# EAGLE schematic Hive 1.6 (EAGLE 9.6.2)
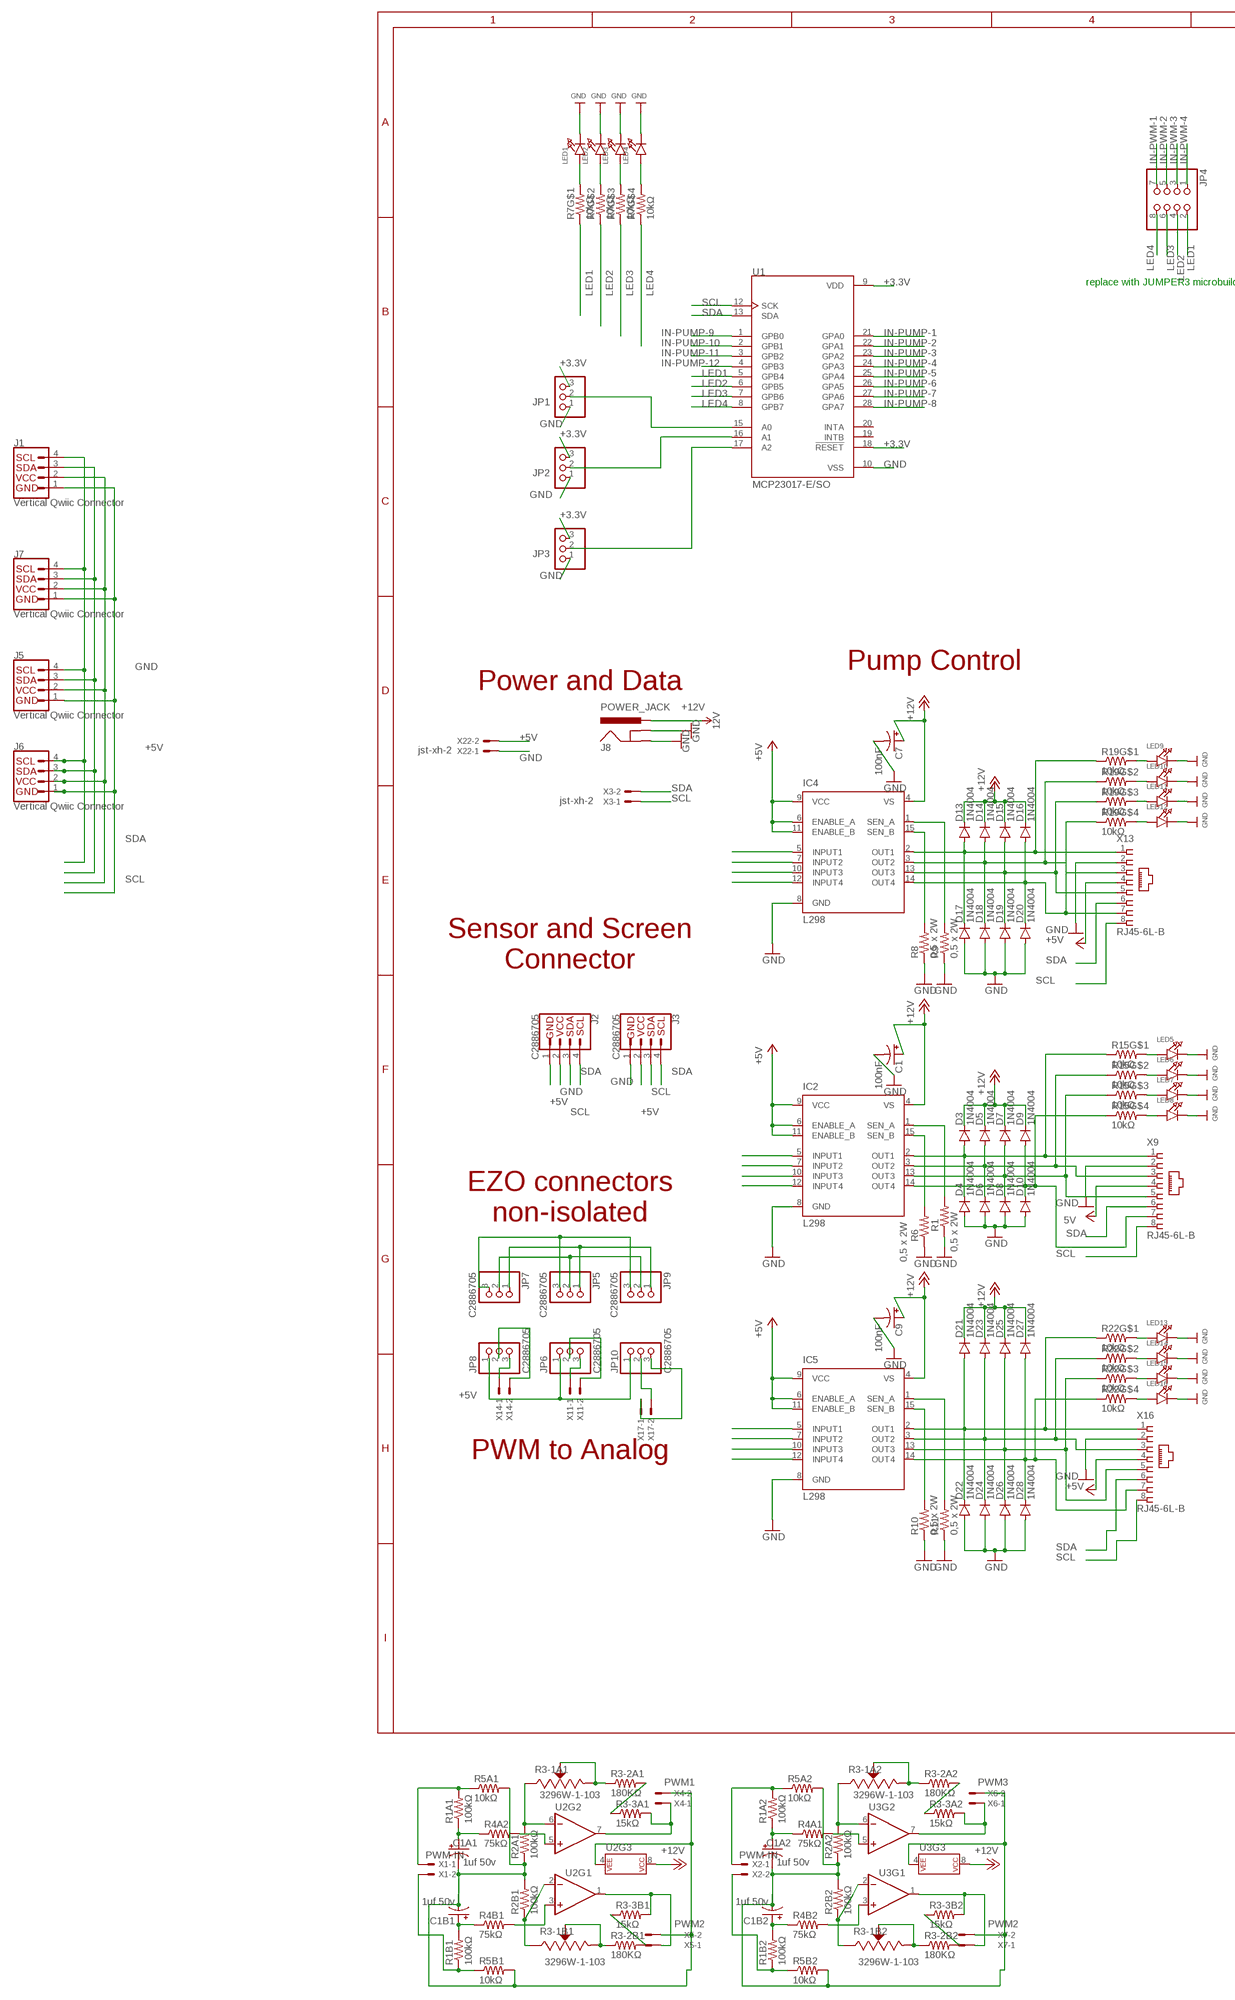
[diagram p0: schematic, sheet 1, part 1 of 2]
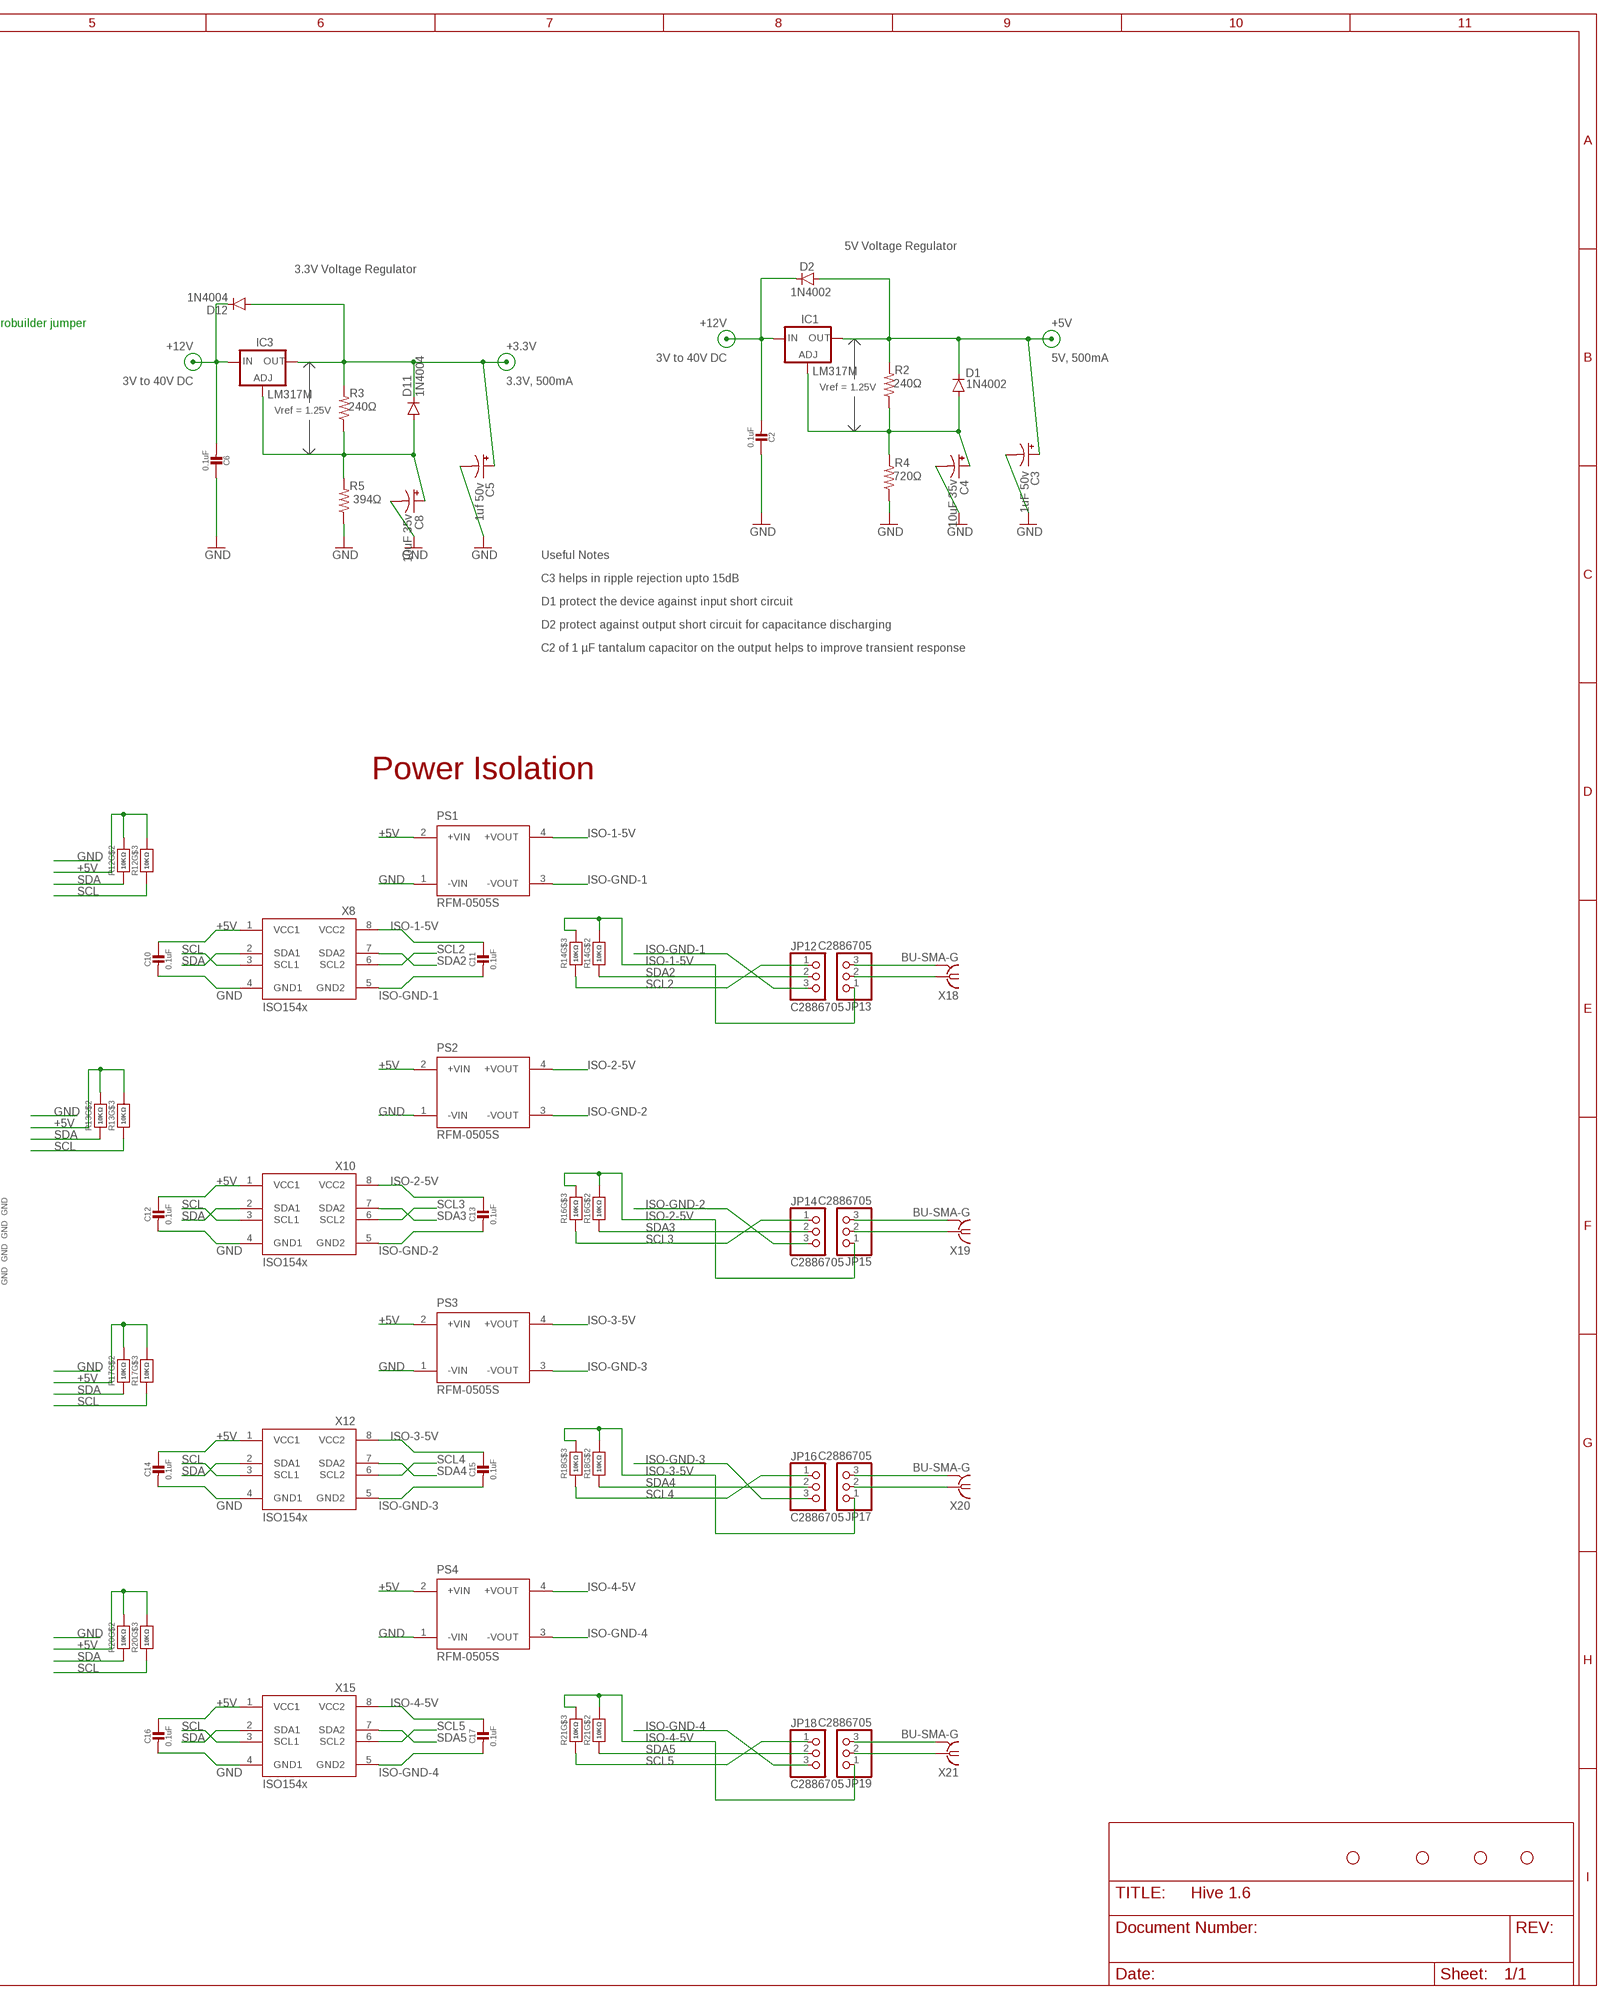
[diagram p1: schematic, sheet 1, part 2 of 2]

## Parts
C1  100nF  CPOL-USUD-4X5,8  [UD-4X5,8_NICHICON]
C1A1  1uf 50v  CPOL-USUD-4X5,8  [UD-4X5,8_NICHICON]
C1A2  1uf 50v  CPOL-USUD-4X5,8  [UD-4X5,8_NICHICON]
C1B1  1uf 50v  CPOL-USUD-4X5,8  [UD-4X5,8_NICHICON]
C1B2  1uf 50v  CPOL-USUD-4X5,8  [UD-4X5,8_NICHICON]
C2  0.1uF  CAP_CERAMIC0603_NO  [0603-NO]
C3  1uF 50v  CPOL-USUD-4X5,8  [UD-4X5,8_NICHICON]
C4  10uF 35v  CPOL-USUD-4X5,8  [UD-4X5,8_NICHICON]
C5  1uf 50v  CPOL-USUD-4X5,8  [UD-4X5,8_NICHICON]
C6  0.1uF  CAP_CERAMIC0603_NO  [0603-NO]
C7  100nF  CPOL-USUD-4X5,8  [UD-4X5,8_NICHICON]
C8  10uF 35v  CPOL-USUD-4X5,8  [UD-4X5,8_NICHICON]
C9  100nF  CPOL-USUD-4X5,8  [UD-4X5,8_NICHICON]
C10  0.1uF  CAP_CERAMIC0603_NO  [0603-NO]
C11  0.1uF  CAP_CERAMIC0603_NO  [0603-NO]
C12  0.1uF  CAP_CERAMIC0603_NO  [0603-NO]
C13  0.1uF  CAP_CERAMIC0603_NO  [0603-NO]
C14  0.1uF  CAP_CERAMIC0603_NO  [0603-NO]
C15  0.1uF  CAP_CERAMIC0603_NO  [0603-NO]
C16  0.1uF  CAP_CERAMIC0603_NO  [0603-NO]
C17  0.1uF  CAP_CERAMIC0603_NO  [0603-NO]
D1  1N4002  DIODE-DO214BA  [DO214BA]
D2  1N4002  DIODE-DO214BA  [DO214BA]
D3  1N4004  DIODE-DO214BA  [DO214BA]
D4  1N4004  DIODE-DO214BA  [DO214BA]
D5  1N4004  DIODE-DO214BA  [DO214BA]
D6  1N4004  DIODE-DO214BA  [DO214BA]
D7  1N4004  DIODE-DO214BA  [DO214BA]
D8  1N4004  DIODE-DO214BA  [DO214BA]
D9  1N4004  DIODE-DO214BA  [DO214BA]
D10  1N4004  DIODE-DO214BA  [DO214BA]
D11  1N4004  DIODE-DO214BA  [DO214BA]
D12  1N4004  DIODE-DO214BA  [DO214BA]
D13  1N4004  DIODE-DO214BA  [DO214BA]
D14  1N4004  DIODE-DO214BA  [DO214BA]
D15  1N4004  DIODE-DO214BA  [DO214BA]
D16  1N4004  DIODE-DO214BA  [DO214BA]
D17  1N4004  DIODE-DO214BA  [DO214BA]
D18  1N4004  DIODE-DO214BA  [DO214BA]
D19  1N4004  DIODE-DO214BA  [DO214BA]
D20  1N4004  DIODE-DO214BA  [DO214BA]
D21  1N4004  DIODE-DO214BA  [DO214BA]
D22  1N4004  DIODE-DO214BA  [DO214BA]
D23  1N4004  DIODE-DO214BA  [DO214BA]
D24  1N4004  DIODE-DO214BA  [DO214BA]
D25  1N4004  DIODE-DO214BA  [DO214BA]
D26  1N4004  DIODE-DO214BA  [DO214BA]
D27  1N4004  DIODE-DO214BA  [DO214BA]
D28  1N4004  DIODE-DO214BA  [DO214BA]
H1  STAND-OFF  [STAND-OFF]
H2  STAND-OFF  [STAND-OFF]
H3  STAND-OFF  [STAND-OFF]
H4  STAND-OFF  [STAND-OFF]
IC1  LM317MBSTT3  [SOT223]
IC2  L298  [MULTIWATT-15]
IC3  LM317MBSTT3  [SOT223]
IC4  L298  [MULTIWATT-15]
IC5  L298  [MULTIWATT-15]
J1  Vertical Qwiic Connector  QWIIC_CONNECTOR  [JST04_1MM_VERT]
J2  C2886705  I2C_STANDARD  [1X04]
J3  C2886705  I2C_STANDARD  [1X04]
J5  Vertical Qwiic Connector  QWIIC_CONNECTOR  [JST04_1MM_VERT]
J6  Vertical Qwiic Connector  QWIIC_CONNECTOR  [JST04_1MM_VERT]
J7  Vertical Qwiic Connector  QWIIC_CONNECTOR  [JST04_1MM_VERT]
J8  POWER_JACK  [POWER_JACK_PTH]
JP1  HEADER-1X3ROUND  [1X03_ROUND]
JP2  HEADER-1X3ROUND  [1X03_ROUND]
JP3  HEADER-1X3ROUND  [1X03_ROUND]
JP4  PINHD-2X4  [2X04]
JP5  C2886705  PINHD-1X3CB  [1X03-CLEANBIG]
JP6  C2886705  PINHD-1X3CB  [1X03-CLEANBIG]
JP7  C2886705  PINHD-1X3CB  [1X03-CLEANBIG]
JP8  C2886705  PINHD-1X3CB  [1X03-CLEANBIG]
JP9  C2886705  PINHD-1X3CB  [1X03-CLEANBIG]
JP10  C2886705  PINHD-1X3CB  [1X03-CLEANBIG]
JP12  C2886705  PINHD-1X3CB  [1X03-CLEANBIG]
JP13  C2886705  PINHD-1X3CB  [1X03-CLEANBIG]
JP14  C2886705  PINHD-1X3CB  [1X03-CLEANBIG]
JP15  C2886705  PINHD-1X3CB  [1X03-CLEANBIG]
JP16  C2886705  PINHD-1X3CB  [1X03-CLEANBIG]
JP17  C2886705  PINHD-1X3CB  [1X03-CLEANBIG]
JP18  C2886705  PINHD-1X3CB  [1X03-CLEANBIG]
JP19  C2886705  PINHD-1X3CB  [1X03-CLEANBIG]
LED1  LED0603  [CHIPLED_0603]
LED2  LED0603  [CHIPLED_0603]
LED3  LED0603  [CHIPLED_0603]
LED4  LED0603  [CHIPLED_0603]
LED5  LED0603  [CHIPLED_0603]
LED6  LED0603  [CHIPLED_0603]
LED7  LED0603  [CHIPLED_0603]
LED8  LED0603  [CHIPLED_0603]
LED9  LED0603  [CHIPLED_0603]
LED10  LED0603  [CHIPLED_0603]
LED11  LED0603  [CHIPLED_0603]
LED12  LED0603  [CHIPLED_0603]
LED13  LED0603  [CHIPLED_0603]
LED14  LED0603  [CHIPLED_0603]
LED15  LED0603  [CHIPLED_0603]
LED16  LED0603  [CHIPLED_0603]
PS1  RFM-0505S  [CONV_RFM-0505S]
PS2  RFM-0505S  [CONV_RFM-0505S]
PS3  RFM-0505S  [CONV_RFM-0505S]
PS4  RFM-0505S  [CONV_RFM-0505S]
R1  0,5 x 2W  R-US_R2512  [R2512]
R1A1  100kΩ  R-US_M1206  [M1206]
R1A2  100kΩ  R-US_M1206  [M1206]
R1B1  100kΩ  R-US_M1206  [M1206]
R1B2  100kΩ  R-US_M1206  [M1206]
R2  240Ω  R-US_M0805  [M0805]
R2A1  100kΩ  R-US_M1206  [M1206]
R2A2  100kΩ  R-US_M1206  [M1206]
R2B1  100kΩ  R-US_M1206  [M1206]
R2B2  100kΩ  R-US_M1206  [M1206]
R3  240Ω  R-US_M0805  [M0805]
R3-1A1  3296W-1-103  [TRIM_3296W-1-103]
R3-1A2  3296W-1-103  [TRIM_3296W-1-103]
R3-1B1  3296W-1-103  [TRIM_3296W-1-103]
R3-1B2  3296W-1-103  [TRIM_3296W-1-103]
R3-2A1  180KΩ  R-US_M1206  [M1206]
R3-2A2  180KΩ  R-US_M1206  [M1206]
R3-2B1  180KΩ  R-US_M1206  [M1206]
R3-2B2  180KΩ  R-US_M1206  [M1206]
R3-3A1  15kΩ  R-US_M1206  [M1206]
R3-3A2  15kΩ  R-US_M1206  [M1206]
R3-3B1  15kΩ  R-US_M1206  [M1206]
R3-3B2  15kΩ  R-US_M1206  [M1206]
R4  720Ω  R-US_M0805  [M0805]
R4A1  75kΩ  R-US_M1206  [M1206]
R4A2  75kΩ  R-US_M1206  [M1206]
R4B1  75kΩ  R-US_M1206  [M1206]
R4B2  75kΩ  R-US_M1206  [M1206]
R5  394Ω  R-US_M0805  [M0805]
R5A1  10kΩ  R-US_M1206  [M1206]
R5A2  10kΩ  R-US_M1206  [M1206]
R5B1  10kΩ  R-US_M1206  [M1206]
R5B2  10kΩ  R-US_M1206  [M1206]
R6  0,5 x 2W  R-US_R2512  [R2512]
R7  10kΩ  RESISTOR_4PACK_US  [RESPACK_4X0603]
R8  0,5 x 2W  R-US_R2512  [R2512]
R9  0,5 x 2W  R-US_R2512  [R2512]
R10  0,5 x 2W  R-US_R2512  [R2512]
R11  0,5 x 2W  R-US_R2512  [R2512]
R12  10KΩ  RESISTOR_4PACK  [RESPACK_4X0603]
R13  10KΩ  RESISTOR_4PACK  [RESPACK_4X0603]
R14  10KΩ  RESISTOR_4PACK  [RESPACK_4X0603]
R15  10kΩ  RESISTOR_4PACK_US  [RESPACK_4X0603]
R16  10KΩ  RESISTOR_4PACK  [RESPACK_4X0603]
R17  10KΩ  RESISTOR_4PACK  [RESPACK_4X0603]
R18  10KΩ  RESISTOR_4PACK  [RESPACK_4X0603]
R19  10kΩ  RESISTOR_4PACK_US  [RESPACK_4X0603]
R20  10KΩ  RESISTOR_4PACK  [RESPACK_4X0603]
R21  10KΩ  RESISTOR_4PACK  [RESPACK_4X0603]
R22  10kΩ  RESISTOR_4PACK_US  [RESPACK_4X0603]
U1  MCP23017-E/SO  [SOIC127P1030X265-28N]
U2  LM358  LM358SO08  [SO08]
U3  LM358  LM358SO08  [SO08]
X1  PWM-IN  JST-XH-02-PIN-LONG-PAD  [JST-XH-02-PACKAGE-LONG-PAD]
X2  PWM-IN  JST-XH-02-PIN-LONG-PAD  [JST-XH-02-PACKAGE-LONG-PAD]
X3  jst-xh-2  JST-XH-02-PIN-LONG-PAD  [JST-XH-02-PACKAGE-LONG-PAD]
X4  PWM1  JST-XH-02-PIN-LONG-PAD  [JST-XH-02-PACKAGE-LONG-PAD]
X5  PWM2  JST-XH-02-PIN-LONG-PAD  [JST-XH-02-PACKAGE-LONG-PAD]
X6  PWM3  JST-XH-02-PIN-LONG-PAD  [JST-XH-02-PACKAGE-LONG-PAD]
X7  PWM2  JST-XH-02-PIN-LONG-PAD  [JST-XH-02-PACKAGE-LONG-PAD]
X8  ISO154X  [SOIC8_150MIL]
X9  RJ45-6L-B  [RJ45-NO-SHIELD]
X10  ISO154X  [SOIC8_150MIL]
X11  jst-xh-2  JST-XH-02-PIN-LONG-PAD  [JST-XH-02-PACKAGE-LONG-PAD]
X12  ISO154X  [SOIC8_150MIL]
X13  RJ45-6L-B  [RJ45-NO-SHIELD]
X14  jst-xh-2  JST-XH-02-PIN-LONG-PAD  [JST-XH-02-PACKAGE-LONG-PAD]
X15  ISO154X  [SOIC8_150MIL]
X16  RJ45-6L-B  [RJ45-NO-SHIELD]
X17  jst-xh-2  JST-XH-02-PIN-LONG-PAD  [JST-XH-02-PACKAGE-LONG-PAD]
X18  BU-SMA-G  [BU-SMA-G]
X19  BU-SMA-G  [BU-SMA-G]
X20  BU-SMA-G  [BU-SMA-G]
X21  BU-SMA-G  [BU-SMA-G]
X22  jst-xh-2  JST-XH-02-PIN-LONG-PAD  [JST-XH-02-PACKAGE-LONG-PAD]

## Nets
+3.3V [3.3v]: C5.+ D11.C D12.A IC3.4(OUT) JP1.3 JP2.3 JP3.3 R3.2 U1.9(VDD) U1.18(!RESET)
+5V [5v]: C3.+ C10.1 C12.1 C14.1 C16.1 D1.C D2.A IC1.4(OUT) IC2.6(ENABLE_A) IC2.9(VCC) IC2.11(ENABLE_B) IC4.6(ENABLE_A) IC4.9(VCC) IC4.11(ENABLE_B) IC5.6(ENABLE_A) IC5.9(VCC) IC5.11(ENABLE_B) J1.3 J2.1 J3.2 J5.3 J6.3 J7.3 JP6.1 JP8.1 JP10.1 PS1.2(+VIN) PS2.2(+VIN) PS3.2(+VIN) PS4.2(+VIN) R2.2 R12.6 R12.7 R13.6 R13.7 R17.6 R17.7 R20.6 R20.7 X8.1(VCC1) X9.4 X10.1(VCC1) X12.1(VCC1) X13.4 X15.1(VCC1) X16.4 X22.2 ; supply symbol labelled +3V3
+12V [12v]: C1.+ C2.2 C6.2 C7.+ C9.+ D2.C D3.C D5.C D7.C D9.C D12.C D13.C D14.C D15.C D16.C D21.C D23.C D25.C D27.C IC1.3(IN) IC2.4(VS) IC3.3(IN) IC4.4(VS) IC5.4(VS) J8.PWR U2.8(P$V+) U3.8(P$V+) ; supply symbol labelled 12V
GND: C1.- C1A1.- C1A2.- C1B1.- C1B2.- C2.1 C3.- C4.- C5.- C6.1 C7.- C8.- C9.- C10.2 C12.2 C14.2 C16.2 D4.A D6.A D8.A D10.A D17.A D18.A D19.A D20.A D22.A D24.A D26.A D28.A IC2.8(GND) IC4.8(GND) IC5.8(GND) J1.4 J2.2 J3.1 J5.4 J6.4 J7.4 J8.GND J8.GNDBREAK JP1.1 JP2.1 JP3.1 JP5.3 JP7.3 JP9.3 LED1.C LED2.C LED3.C LED4.C LED5.C LED6.C LED7.C LED8.C LED9.C LED10.C LED11.C LED12.C LED13.C LED14.C LED15.C LED16.C PS1.1(-VIN) PS2.1(-VIN) PS3.1(-VIN) PS4.1(-VIN) R1.1 R2A1.1 R2A2.1 R2B1.2 R2B2.2 R4.1 R5.1 R5A1.2 R5A2.2 R5B1.2 R5B2.2 R6.1 R8.1 R9.1 R10.1 R11.1 U1.10(VSS) U2.4(P$V-) U3.4(P$V-) X4.2 X5.2 X6.2 X7.2 X8.4(GND1) X9.2 X10.4(GND1) X12.4(GND1) X13.2 X15.4(GND1) X16.2 X22.1
IN-PUMP-1: IC2.5(INPUT1) U1.21(GPA0)
IN-PUMP-2: IC2.7(INPUT2) U1.22(GPA1)
IN-PUMP-3: IC2.10(INPUT3) U1.23(GPA2)
IN-PUMP-4: IC2.12(INPUT4) U1.24(GPA3)
IN-PUMP-5 [GPIO]: IC4.5(INPUT1) U1.25(GPA4)
IN-PUMP-6 [GPIO]: IC4.7(INPUT2) U1.26(GPA5)
IN-PUMP-7 [GPIO]: IC4.10(INPUT3) U1.27(GPA6)
IN-PUMP-8 [GPIO]: IC4.12(INPUT4) U1.28(GPA7)
IN-PUMP-9 [GPIO]: IC5.5(INPUT1) U1.1(GPB0)
IN-PUMP-10 [GPIO]: IC5.7(INPUT2) U1.2(GPB1)
IN-PUMP-11 [GPIO]: IC5.10(INPUT3) U1.3(GPB2)
IN-PUMP-12 [GPIO]: IC5.12(INPUT4) U1.4(GPB3)
IN-PWM-1: JP4.7 R1A1.2 R5A1.1 X1.1
IN-PWM-2: JP4.5 R1B1.1 R5B1.1 X1.2
IN-PWM-3: JP4.3 R1A2.2 R5A2.1 X2.1
IN-PWM-4: JP4.1 R1B2.1 R5B2.1 X2.2
ISO-1-5V: C11.1 JP13.1 PS1.4(+VOUT) R14.6 R14.7 X8.8(VCC2)
ISO-2-5V: C13.1 JP15.1 PS2.4(+VOUT) R16.6 R16.7 X10.8(VCC2)
ISO-3-5V: C15.1 JP17.1 PS3.4(+VOUT) R18.6 R18.7 X12.8(VCC2)
ISO-4-5V: C17.1 JP19.1 PS4.4(+VOUT) R21.6 R21.7 X15.8(VCC2)
ISO-GND-1: C11.2 JP12.3 PS1.3(-VOUT) X8.5(GND2)
ISO-GND-2: C13.2 JP14.3 PS2.3(-VOUT) X10.5(GND2)
ISO-GND-3: C15.2 JP16.3 PS3.3(-VOUT) X12.5(GND2)
ISO-GND-4: C17.2 JP18.3 PS4.3(-VOUT) X15.5(GND2)
ISO-PRB-1+: JP13.2 X18.1
ISO-PRB-1GND: JP13.3 X18.2 X18.3 X18.4 X18.5
ISO-PRB-2+: JP15.2 X19.1
ISO-PRB-2GND: JP15.3 X19.2 X19.3 X19.4 X19.5
ISO-PRB-3+: JP17.2 X20.1
ISO-PRB-3GND: JP17.3 X20.2 X20.3 X20.4 X20.5
ISO-PRB-4+: JP19.2 X21.1
ISO-PRB-4GND: JP19.3 X21.2 X21.3 X21.4 X21.5
LED1: JP4.2 R7.1 U1.5(GPB4)
LED2: JP4.4 R7.2 U1.6(GPB5)
LED3: JP4.6 R7.3 U1.7(GPB6)
LED4: JP4.8 R7.4 U1.8(GPB7)
N$1: IC4.1(SEN_A) R9.2
N$2: IC4.15(SEN_B) R8.2
N$3: IC5.1(SEN_A) R11.2
N$4: IC5.15(SEN_B) R10.2
N$5: C8.+ D11.A IC3.1(ADJ) R3.1 R5.2
N$6: R2A1.2 R3-1A1.1(CCW) U2.6(-IN)
N$7: LED1.A R7.8
N$8: R2B1.1 R3-1B1.1(CCW) U2.2(-IN)
N$9: IC2.1(SEN_A) R1.2
N$10: IC2.15(SEN_B) R6.2
N$11: C4.+ D1.A IC1.1(ADJ) R2.1 R4.2
N$13: LED2.A R7.7
N$17: R3-1B1.2(WIPER) R3-1B1.3(CW) R3-2B1.1
N$18: R3-2B1.2 R3-3B1.1
N$19: R3-1A1.2(WIPER) R3-1A1.3(CW) R3-2A1.1
N$20: R3-2A1.2 R3-3A1.1
N$21: C1A1.+ R1A1.1 R4A2.1
N$22: C1B1.+ R1B1.2 R4B1.1
N$23: LED13.A R22.8
N$24: LED14.A R22.7
N$25: R4A2.2 U2.5(+IN)
N$26: R4B1.2 U2.3(+IN)
N$27: R3-1B2.2(WIPER) R3-1B2.3(CW) R3-2B2.1
N$28: LED15.A R22.6
N$29: LED16.A R22.5
N$30: LED8.A R15.5
N$39: LED7.A R15.6
N$41: LED6.A R15.7
N$43: LED5.A R15.8
N$44: LED9.A R19.8
N$45: LED10.A R19.7
N$46: LED11.A R19.6
N$47: LED12.A R19.5
N$48: LED3.A R7.6
N$49: LED4.A R7.5
N$50: R3-2B2.2 R3-3B2.1
N$51: R3-1A2.2(WIPER) R3-1A2.3(CW) R3-2A2.1
N$52: R3-2A2.2 R3-3A2.1
N$53: C1A2.+ R1A2.1 R4A1.1
N$54: C1B2.+ R1B2.2 R4B2.1
N$55: R2A2.2 R3-1A2.1(CCW) U3.6(-IN)
N$56: R2B2.1 R3-1B2.1(CCW) U3.2(-IN)
N$57: R4A1.2 U3.5(+IN)
N$58: R4B2.2 U3.3(+IN)
N$74: JP1.2 U1.15(A0)
N$75: JP2.2 U1.16(A1)
N$76: JP3.2 U1.17(A2)
NISO-PRB-1+: JP6.2 X11.2
NISO-PRB-1GND: JP6.3 X11.1
NISO-PRB-2+: JP8.2 X14.2
NISO-PRB-2GND: JP8.3 X14.1
NISO-PRB-3+: JP10.2 X17.2
NISO-PRB-3GND: JP10.3 X17.1
OUT-PUMP-1 [highpower]: D3.A D4.C IC2.2(OUT1) R15.1 X9.1
OUT-PUMP-2 [highpower]: D5.A D6.C IC2.3(OUT2) R15.2 X9.3
OUT-PUMP-3 [highpower]: D7.A D8.C IC2.13(OUT3) R15.3 X9.5
OUT-PUMP-4 [highpower]: D9.A D10.C IC2.14(OUT4) R15.4 X9.7
OUT-PUMP-5 [highpower]: D13.A D17.C IC4.2(OUT1) R19.1 X13.1
OUT-PUMP-6 [highpower]: D14.A D18.C IC4.3(OUT2) R19.2 X13.3
OUT-PUMP-7 [highpower]: D15.A D19.C IC4.13(OUT3) R19.3 X13.5
OUT-PUMP-8 [highpower]: D16.A D20.C IC4.14(OUT4) R19.4 X13.7
OUT-PUMP-9 [highpower]: D21.A D22.C IC5.2(OUT1) R22.1 X16.1
OUT-PUMP-10 [highpower]: D23.A D24.C IC5.3(OUT2) R22.2 X16.3
OUT-PUMP-11 [highpower]: D25.A D26.C IC5.13(OUT3) R22.3 X16.5
OUT-PUMP-12: D27.A D28.C IC5.14(OUT4) R22.4 X16.7
PWM-OUT-1: R3-3A1.2 U2.7(OUT) X4.1
PWM-OUT-2: R3-3B1.2 U2.1(OUT) X5.1
PWM-OUT-3: R3-3A2.2 U3.7(OUT) X6.1
PWM-OUT-4: R3-3B2.2 U3.1(OUT) X7.1
SCL: J1.1 J2.3 J3.3 J5.1 J6.1 J7.1 JP5.1 JP7.1 JP9.1 R12.3 R13.3 R17.3 R20.3 U1.12(SCK) X3.1 X8.3(SCL1) X9.8 X10.3(SCL1) X12.3(SCL1) X13.8 X15.3(SCL1) X16.8
SCL2: JP12.1 R14.3 X8.6(SCL2)
SCL3: JP14.1 R16.3 X10.6(SCL2)
SCL4: JP16.1 R18.3 X12.6(SCL2)
SCL5: JP18.1 R21.3 X15.6(SCL2)
SDA: J1.2 J2.4 J3.4 J5.2 J6.2 J7.2 JP5.2 JP7.2 JP9.2 R12.2 R13.2 R17.2 R20.2 U1.13(SDA) X3.2 X8.2(SDA1) X9.6 X10.2(SDA1) X12.2(SDA1) X13.6 X15.2(SDA1) X16.6
SDA2: JP12.2 R14.2 X8.7(SDA2)
SDA3: JP14.2 R16.2 X10.7(SDA2)
SDA4: JP16.2 R18.2 X12.7(SDA2)
SDA5: JP18.2 R21.2 X15.7(SDA2)
Unconnected: R12.1 R12.4 R12.5 R12.8 R13.1 R13.4 R13.5 R13.8 R14.1 R14.4 R14.5 R14.8 R16.1 R16.4 R16.5 R16.8 R17.1 R17.4 R17.5 R17.8 R18.1 R18.4 R18.5 R18.8 R20.1 R20.4 R20.5 R20.8 R21.1 R21.4 R21.5 R21.8 U1.19(INTB) U1.20(INTA)

## Notes on the sheet
- 5V Voltage Regulator
- 3.3V Voltage Regulator
- replace with JUMPER3 microbuilder jumper
- 3V to 40V DC | 5V, 500mA
- 3V to 40V DC | 3.3V, 500mA
- Vref = 1.25V
- Vref = 1.25V
- Useful Notes
- C3 helps in ripple rejection upto 15dB
- D1 protect the device against input short circuit
- D2 protect against output short circuit for capacitance discharging
- C2 of 1 µF tantalum capacitor on the output helps to improve transient response
- Pump Control
- Power Isolation
- Power and Data
- Sensor and Screen
  Connector
- EZO connectors
  non-isolated
- PWM to Analog

## Library data of the parts
C1 C1A1 C1A2 C1B1 C1B2 C3-C5 C7-C9 = rcl:CPOL-US: POLARIZED CAPACITOR, American symbol; SPICEPREFIX: C
C2 C6 C10-C17 = microbuilder:CAP_CERAMIC: Ceramic Capacitors For new designs, use the packages preceded by an '_' character since they are more reliable: The following footprints should be used on most boards: _0402 - Standard footprint for regular board layouts _0603 - Standard footprint for regular board layouts _0805 - Standard footprint for regular board layouts _1206 - Standard footprint for regular board layouts For extremely tight-pitch boards where space is at a premium, the following 'micro-pitch' footprints can be used (smaller pads, no silkscreen outline, etc.): _0402MP - Micro-pitch footprint for very dense/compact boards _0603MP - Micro-pitch footprint for very dense/compact boards _0805MP - Micro-pitch footprint for very dense/compact boards _1206MP - Micro-pitch footprint for very dense/compact boards
D1-D28 = diode:DIODE-: DIODE
H1-H4 = SparkFun-Hardware:STAND-OFF: Stand Off Drill holes for mechanically mounting via screws, standoffs, etc. Note: Use the keepout ring to avoid running the screw head into surrounding components. Variant Overviews STAND-OFF - Mechanical footprint for a #4 phillips button head screw. STAND-OFF-TIGHT - Mechanical footprint for a #4 phillips button head screw, Example SparkFun Products Screw - Phillips Head (1/4", 4-40, 10 pack) <https://www.sparkfun.com/products/10453> (PRT-10453) Screw - Phillips Head (1/2", 4-40, 10 pack) <https://www.sparkfun.com/products/10452> (PRT-10452) Screw - Phillips Head (3/4", 4-40, 10 pack) <https://www.sparkfun.com/products/10451> (PRT-10451) Screw - Phillips Head (1", 4-40, 10 pack) <https://www.sparkfun.com/products/10450> (PRT-10450)
IC1 IC3 = v-reg:LM317?*: 500 mA Adjustable Output Positive Voltage Regulator Source: http://www.onsemi.co.jp .. LM317M-D.PDF; PARTNUMBER: LM317M
IC2 IC4 IC5 = st-microelectronics:L298: DUAL FULL-BRIDGE DRIVER; MPN: L298N; OC_FARNELL: 1589425; OC_NEWARK: 32M1527
J1 J5-J7 = SparkFun-Connectors:QWIIC_CONNECTOR: SparkFun I2C Standard Qwiic Connector An SMD 1mm pitch JST connector makes it easy and quick (get it? Qwiic?) to connect I2C devices to each other. The Qwiic system <http://www.sparkfun.com/qwiic> enables fast and solderless connection between popular platforms and various sensors and actuators. We carry 200mm <https://www.sparkfun.com/products/14204>, 100mm <https://www.sparkfun.com/products/14205>, 50mm <https://www.sparkfun.com/products/14206>, and breadboard friendly <https://www.sparkfun.com/products/14207> Qwiic cables. We also offer 10 pcs strips <https://www.sparkfun.com/products/14323> the SMD connectors.; PROD_ID: CONN-14483
J2 J3 = SparkFun-Connectors:I2C_STANDARD: SparkFun I2C Standard Pinout Header SparkFun has standardized on a pinout for all I2C based sensor breakouts. This pinout allows I2C boards to be plugged directly into the headers on Arduino Uno compatible boards, and to be daisy chained easily. Example SparkFun Products: SparkFun Atmospheric Sensor Breakout - BME280 <https://www.sparkfun.com/products/13676> SparkFun Altitude/Pressure Sensor Breakout - MPL3115A2 <https://www.sparkfun.com/products/11084> SparkFun TOF Range Finder Sensor - VL6180 <https://www.sparkfun.com/products/12785>
J8 = SparkFun-Connectors:POWER_JACK: Power Jack Connector This is the standard 5.5mm barrel jack for power. The PTH is the most common, proven, reliable, footprint. The Slot footprint only works if the mill layer is transmitted to the PCB fab house so be warned. Here are the connectors we sell at SparkFun: DC Barrel Power Jack/Connector <https://www.sparkfun.com/products/119> (PRT-00119) DC Barrel Power Jack/Connector (SMD) <https://www.sparkfun.com/products/12748> (PRT-12748) DC Barrel Jack Adapter - Breadboard Compatible <https://www.sparkfun.com/products/10811> (PRT-10811) It is used on this SparkFun product (and many, many others): SparkFun RedBoard - Programmed with Arduino <https://www.sparkfun.com/products/12757> (DEV-12757) Also, if you need a mating power supply or connector, please check these out: Wall Adapter Power Supply - 9VDC 650mA <https://www.sparkfun.com/products/298> (TOL-00298) DC Barrel Jack Adapter - Male <https://www.sparkfun.com/products/10287> (PRT-10287); PROD_ID: CONN-08197
JP1-JP3 = microbuilder:HEADER-1X3: PIN HEADER
JP4 = pinhead:PINHD-2X4: PIN HEADER
JP5-JP10 JP12-JP19 = adafruit:PINHD-1X3: PIN HEADER
LED1-LED16 = microbuilder:LED: LED 0603 - 0603 Surface Mount Package 2mA: Green LED - Low Power (3.9mcd, 2ma, 1.7Vf) - Digikey: 475-2709-2-ND Orange LED - Low Power (9.8mcd, 2ma, 1.8Vf) - Digikey: 475-1194-2-ND Red LED - Low Power (5mcd, 2ma, 1.8Vf) - Digikey: 475-1195-2-ND Yellow LED - Low Power (7mcd, 2ma, 1.8Vf) - Digikey: 475-1196-2-ND 5mA: Blue LED - Low Power (17mcd, 5ma, 2.9Vf) - Digikey: LNJ937W8CRACT-ND 0805 - 0805 Surface Mount Package 2mA: Red LED (8.8mcd, 2mA, 1.8Vf, Clear) - Low Power [Digikey: 475-2510-1-ND] Green LED (5mcd, 2mA, 1.8Vf, Clear) - Low Power [Digikey: 475-2730-1-ND] Yellow LED (11.3mcd, 2mA, 1.8Vf, Clear) - Low Power [Digikey: 475-2555-1-ND] 20mA: Red LED (104mcd, 20mA, Diffused) - LS R976 [Digikey: 475-1278-6-ND] Red LED (12mcd, 20mA, 2.0Vf, Clear) - APT2012EC [Digikey: 754-1128-1-ND] Green LED (15mcd, 20mA, 2.2Vf, Clear) - APT2012GC [Digikey: 754-1131-1-ND] Orange LED (160mcd, 20mA, 2.1Vf, Clear) - APT2012SECK [Digikey: 754-1130-1-ND] 1206 - 1206 Surface Mount Package Green LED (26mcd, 20mA, Diffused) - LG N971 [Digikey: 475-1407-6-ND] Red LED (15mcd, 20mA, Diffused) - LH N974 [Digikey: 475-1416-6-ND]
PS1-PS4 = RFM-0505S:RFM-0505S: DC/DC Converter, 1 Watt, SIP4, Single Output Check availability <https://pricing.snapeda.com/parts/RFM-0505S/Recom%20Power/view-part?ref=eda>; AVAILABILITY: In Stock; DESCRIPTION: 1W DC/DC-Converter 'ECONOLINE' SIP4 1kV unreg; MF: Recom Power; MP: RFM-0505S; PACKAGE: SIP-4 Recom Power; PRICE: None; PURCHASE-URL: https://pricing.snapeda.com/search/part/RFM-0505S/?ref=eda
R1 R1A1 R1A2 R1B1 R1B2 R2A1 R2A2 R2B1 R2B2 R3-2A1 R3-2A2 R3-2B1 R3-2B2 R3-3A1 R3-3A2 R3-3B1 R3-3B2 R4A1 R4A2 R4B1 R4B2 R5A1 R5A2 R5B1 R5B2 R6 R8-R11 = adafruit:R-US_: RESISTOR, American symbol
R2-R5 = resistor:R-US_: RESISTOR, American symbol
R3-1A1 R3-1A2 R3-1B1 R3-1B2 = 3296W-1-103:3296W-1-103: Res Cermet Trimmer 500K Ohm 10% 0.5W 25(Elec)Turn 2.19mm (9.53 X 4.83 X 11.55mm) Pin Thru-Hole Tube Check availability <https://pricing.snapeda.com/parts/3296W-1-103/Bourns/view-part?ref=eda>; AVAILABILITY: In Stock; DESCRIPTION: 10 kOhms 0.5W, 1/2W PC Pins Through Hole Trimmer Potentiometer Cermet 25.0 Turn Top Adjustment; MF: Bourns; MP: 3296W-1-103; PACKAGE: SOT-23-5 Bourns; PRICE: None; PURCHASE-URL: https://pricing.snapeda.com/search/part/3296W-1-103/?ref=eda
R7 R15 R19 R22 = microbuilder:RESISTOR_4PACK_US: Resistor Packs (4 resistors) 4 x 0603 10K 1/16W - Digikey: YC164J-10KCT-ND
R12-R14 R16-R18 R20 R21 = microbuilder:RESISTOR_4PACK: Resistor Packs (4 resistors) 4 x 0603 10K 1/16W - Digikey: YC164J-10KCT-ND
U1 = MCP23017-E_SO:MCP23017-E/SO: MCP23017 Series 5.5 V 1.7 MHz SMT 16-Bit I2C I/O Expander - SOIC-28 Check availability <https://pricing.snapeda.com/parts/MCP23017-E/SO/Microchip/view-part?ref=eda>; AVAILABILITY: In Stock; DESCRIPTION: I/O Expander 16 I²C 1.7 MHz 28-SOIC; MF: Microchip; MP: MCP23017-E/SO; PACKAGE: SOIC-28 Microchip; PRICE: None; PURCHASE-URL: https://pricing.snapeda.com/search/part/MCP23017-E/SO/?ref=eda
U2 U3 = SparkFun-IC-Amplifiers:LM358: LM358 Jellybean op-amp Datasheet <http://www.sparkfun.com/datasheets/Components/General/LM358.pdf> SparkFun Products Op-Amp (Thru-Hole) - LM358 <https://www.sparkfun.com/products/9456> (COM-09456)
X1-X7 X11 X14 X17 X22 = Rembrandt Electronics - JST XH Connectors v1-0:JST-XH-02-PIN: JST XH Connector 2 Pin Wire to board connector. Pitch: 2,54 mm, (0.100") Number of pins: 2 Created by Rembrandt Electronics www.rembrandtelectronics.com
X8 X10 X12 X15 = adafruit_power:ISO154X
X9 X13 X16 = con-tycoelectronics:RJ45: CORCOM Modular RJ Jacks No Shield Source: www.tycoelectronics.com .. ENG_DS_1654001_1099_RJ_L_0507.pdf; MPN: RJ45-6L-B; OC_FARNELL: unknown; OC_NEWARK: 16R6090
X18-X21 = con-coax:BU-SMA-G: FEMALE SMA CONNECTOR Radiall distributor RS 193-9117; OC_FARNELL: unknown; OC_NEWARK: unknown

## Net classes
0 default: width 0.229 mm, clearance 0.076 mm
1 highpower: width 0.356 mm, drill 0.356 mm
2 12v: width 0.457 mm, drill 0.102 mm, clearance 0.254 mm
3 5v: width 0.406 mm, drill 0.102 mm, clearance 0.254 mm
4 3.3v: width 0.406 mm, drill 0.102 mm, clearance 0.254 mm
5 i2c: width 0.356 mm, drill 0.102 mm, clearance 0.254 mm
6 GPIO: width 0.356 mm, drill 0.102 mm, clearance 0.254 mm
8 New Class: drill 0.102 mm, clearance 0.152 mm